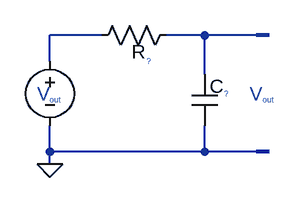
[diagram p0: schematic unknownR-C.asc]
unknownR-C.asc, the LTspice schematic file:
Version 4
SHEET 1 880 680
WIRE 144 112 80 112
WIRE 272 112 224 112
WIRE 336 112 272 112
WIRE 80 144 80 112
WIRE 272 160 272 112
WIRE 80 256 80 224
WIRE 272 256 272 224
WIRE 272 256 80 256
WIRE 336 256 272 256
WIRE 80 272 80 256
FLAG 80 272 0
BUSTAP 352 112 336 112
BUSTAP 352 256 336 256
SYMBOL voltage 80 128 R0
WINDOW 0 24 16 Invisible 2
WINDOW 3 24 96 Invisible 2
SYMATTR InstName V
SYMATTR Value 5V
SYMBOL res 240 96 R90
WINDOW 0 52 50 VBottom 2
WINDOW 3 19 47 Invisible 2
SYMATTR InstName R
SYMBOL cap 256 160 R0
WINDOW 0 22 15 Left 2
WINDOW 3 25 48 Invisible 2
SYMATTR InstName C
TEXT 328 184 Left 2 ;V
TEXT 344 192 Left 0 ;out
TEXT 80 192 Left 0 ;out
TEXT 64 184 Left 2 ;V
TEXT 200 144 Left 0 ;?
TEXT 296 184 Left 0 ;?

The netlist it stands for:
* unknownR-C.asc
V N001 0 5V
R N002 N001 R
C N002 0 C
* V
* out
* out
* V
* ?
* ?
.backanno
.end